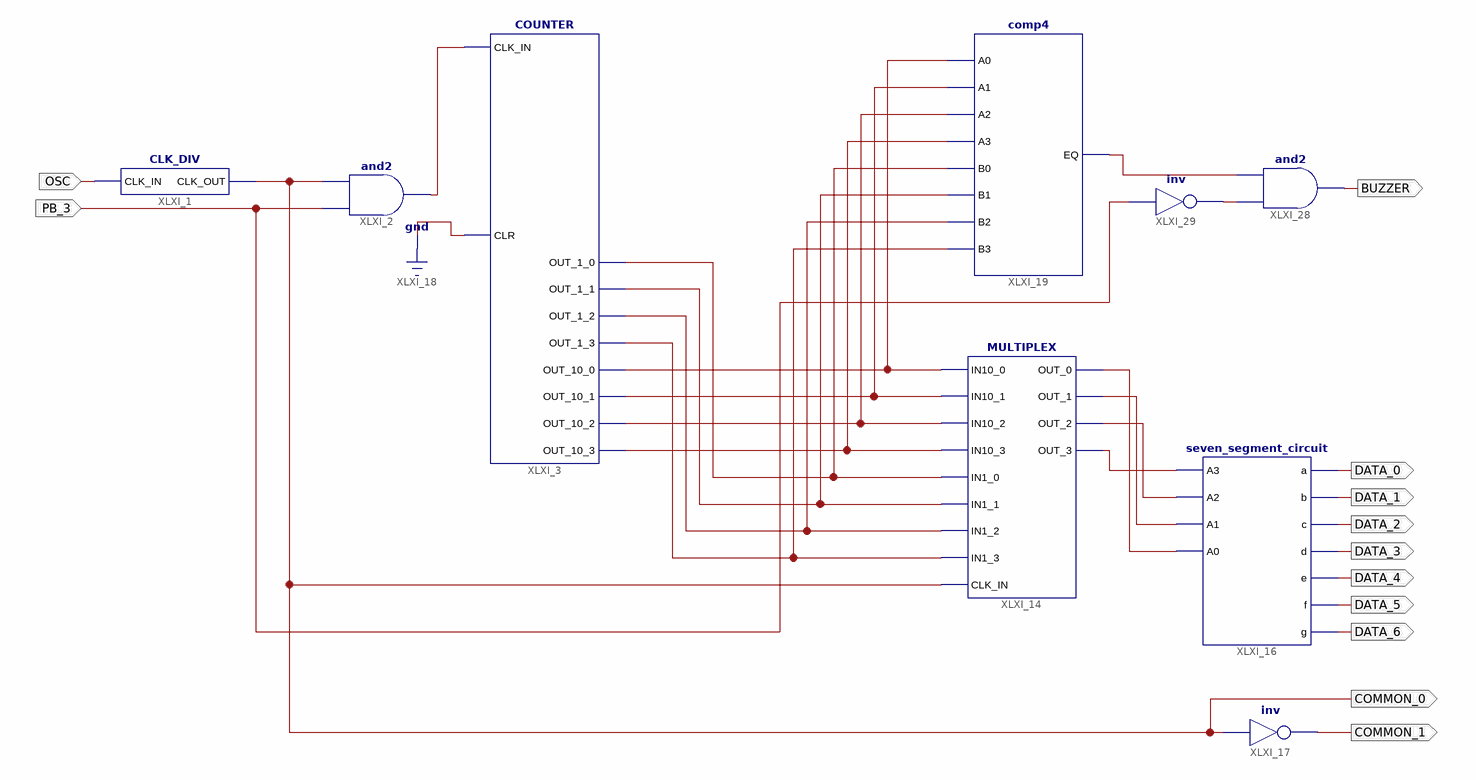
[diagram p0: schematic sheet 1]
// Xilinx ISE schematic main.sch (spartan6) as structural Verilog: 9 symbols, 12 ports
module main (
  input  PB_3,
  input  OSC,
  output DATA_0,
  output DATA_1,
  output DATA_2,
  output DATA_3,
  output DATA_4,
  output DATA_5,
  output DATA_6,
  output COMMON_1,
  output COMMON_0,
  output BUZZER
);

  wire XLXN_4, XLXN_35, XLXN_36, XLXN_37, XLXN_38, XLXN_96, XLXN_97, XLXN_105, XLXN_107, XLXN_108, XLXN_109,
       XLXN_110, XLXN_113, XLXN_125, XLXN_126;

  and XLXI_2 (XLXN_4, PB_3, COMMON_0);
  COUNTER XLXI_3 (
    .CLK_IN(XLXN_4), .CLR(1'b0), .OUT_1_0(XLXN_108), .OUT_1_1(XLXN_109), .OUT_1_2(XLXN_110),
    .OUT_1_3(XLXN_113), .OUT_10_0(XLXN_96), .OUT_10_1(XLXN_97), .OUT_10_2(XLXN_105), .OUT_10_3(XLXN_107));
  CLK_DIV XLXI_1 (.CLK_IN(OSC), .CLK_OUT(COMMON_0));
  comp4 XLXI_19 (
    .A0(XLXN_96), .A1(XLXN_97), .A2(XLXN_105), .A3(XLXN_107), .B0(XLXN_108), .B1(XLXN_109), .B2(XLXN_110),
    .B3(XLXN_113), .EQ(XLXN_126));
  MULTIPLEX XLXI_14 (
    .IN10_0(XLXN_96), .IN1_0(XLXN_108), .IN10_1(XLXN_97), .IN1_1(XLXN_109), .IN10_2(XLXN_105),
    .IN1_2(XLXN_110), .IN10_3(XLXN_107), .IN1_3(XLXN_113), .CLK_IN(COMMON_0), .OUT_0(XLXN_35),
    .OUT_1(XLXN_36), .OUT_2(XLXN_37), .OUT_3(XLXN_38));
  seven_segment_circuit XLXI_16 (
    .A2(XLXN_37), .A1(XLXN_36), .A0(XLXN_35), .A3(XLXN_38), .a(DATA_0), .b(DATA_1), .c(DATA_2), .d(DATA_3),
    .e(DATA_4), .f(DATA_5), .g(DATA_6));
  not XLXI_17 (COMMON_1, COMMON_0);
  not XLXI_29 (XLXN_125, PB_3);
  and XLXI_28 (BUZZER, XLXN_125, XLXN_126);

  // Notes on the sheet:
  //   LOC on signal PB_3 = P47
  //   LOC on signal XLXN_4 = P82
  //   LOC on signal OSC = P123
  //   LOC on signal DATA_0 = P41
  //   LOC on signal DATA_1 = P40
  //   LOC on signal DATA_2 = P35
  //   LOC on signal DATA_3 = P34
  //   LOC on signal DATA_4 = P32
  //   LOC on signal DATA_5 = P29
  //   LOC on signal DATA_6 = P27
  //   LOC on signal COMMON_1 = P43
  //   LOC on signal COMMON_0 = P44
  //   LOC on signal BUZZER = P83
endmodule
